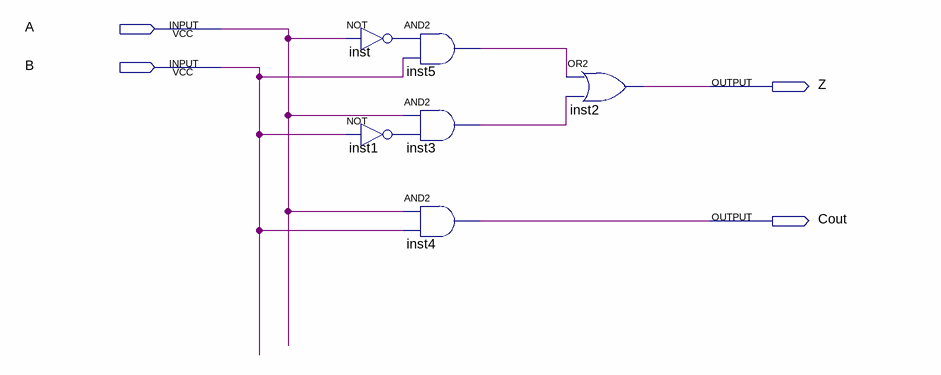
[diagram p0: schematic sheet]
// Quartus schematic halfadder.bdf as structural Verilog: 6 symbols, 4 pins
module halfadder (
  input  A,
  input  B,
  output Z,
  output Cout
);

  wire inst1_out, inst3_out, inst5_out, inst_out;

  not inst (inst_out, A);
  not inst1 (inst1_out, B);
  and inst5 (inst5_out, inst_out, B);
  and inst3 (inst3_out, A, inst1_out);
  and inst4 (Cout, A, B);
  or inst2 (Z, inst5_out, inst3_out);
endmodule
